# EAGLE design schematic (EAGLE 6.5.0)
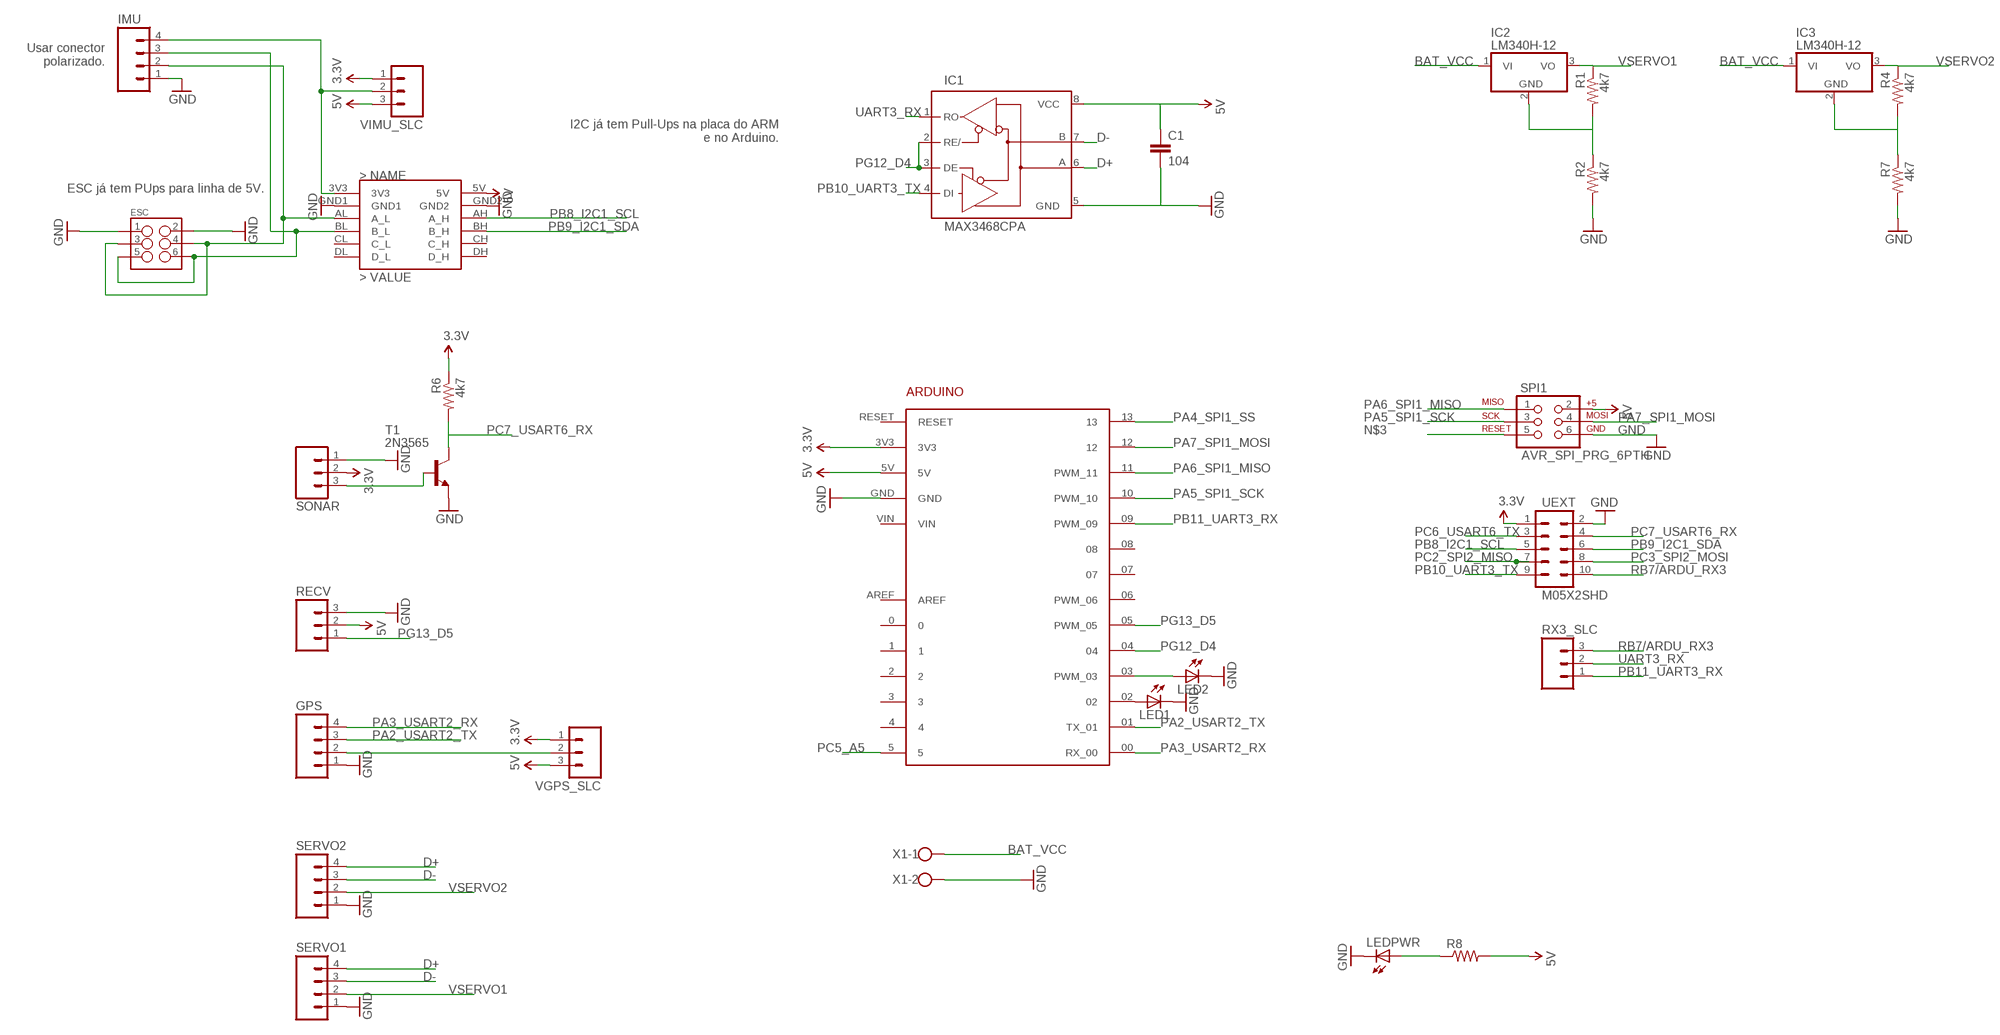
[diagram p0: schematic, sheet 1]

## Parts
ARDUINO1  ARDUINO  [ARDUINO]
C1  104  0.1UF-50V-20%(PTH)KIT-EZ  [CAP-PTH-SMALL-KIT]
ESC  M03X22X3_SILK_SM  [2X3]
GPS  M04PTH  [1X04]
IC1  MAX3468CPA  [DIL08]
IC2  LM340H-12  [TO220H]
IC3  LM340H-12  [TO220H]
IMU  M04PTH  [1X04]
LED1  LED3MM  [LED3MM]
LED2  LED3MM  [LED3MM]
LEDPWR  LED3MM  [LED3MM]
R1  4k7  R-US_0309/V  [0309V]
R2  4k7  R-US_0204/7  [0204/7]
R4  4k7  R-US_0309/V  [0309V]
R6  4k7  R-US_M1406  [M1406]
R7  4k7  R-US_0204/7  [0204/7]
R8  RESISTORPTH-1/6W  [1/6W-RES]
RECV  M03PTH  [1X03]
RX3_SLC  M03PTH  [1X03]
SERVO1  M04PTH  [1X04]
SERVO2  M04PTH  [1X04]
SONAR  M03PTH  [1X03]
SPI1  AVR_SPI_PRG_6PTH  [2X3]
T1  2N3565  [TO92]
U$1  JYMCU_LOGIC_LEVEL_CONVERTER  [JYMCU_LOGIC_LEVEL_SHIFTER_DIP]
UEXT  M05X2SHD  [2X5-SHROUDED]
VGPS_SLC  M03PTH  [1X03]
VIMU_SLC  M03PTH  [1X03]
X1  W237-102  [W237-102]

## Nets
3.3V: ARDUINO1.3V3 R6.1 SONAR.2 UEXT.1 VGPS_SLC.1 VIMU_SLC.1
5V: ARDUINO1.5V C1.1 IC1.8(VCC) R8.2 RECV.2 SPI1.2 U$1.5V VGPS_SLC.3 VIMU_SLC.3
BAT_VCC: IC2.1(VI) IC3.1(VI) X1.1
D+: IC1.6(A) SERVO1.4 SERVO2.4
D-: IC1.7(B) SERVO1.3 SERVO2.3
GND: ARDUINO1.GND C1.2 ESC.1 ESC.2 GPS.1 IC1.5(GND) IMU.1 LED1.K(C) LED2.K(C) LEDPWR.K(C) R2.2 R7.2 RECV.3 SERVO1.1 SERVO2.1 SONAR.1 SPI1.6 T1.3(E) U$1.GND1 U$1.GND2 UEXT.2 X1.2
N$1: IMU.4 U$1.3V3 VIMU_SLC.2
N$3: SPI1.5
N$6: SONAR.3 T1.2(B)
N$7: ESC.3 ESC.4 IMU.2 U$1.AL(A_L)
N$8: GPS.2 VGPS_SLC.2
N$9: ARDUINO1.02 LED1.A
N$10: ARDUINO1.03(PWM_03) LED2.A
N$11: LEDPWR.A R8.1
N$12: ESC.5 ESC.6 IMU.3 U$1.BL(B_L)
N$15: IC3.2(GND) R4.2 R7.1
N$16: IC2.2(GND) R1.2 R2.1
PA2_USART2_TX: ARDUINO1.01(TX_01) GPS.3
PA3_USART2_RX: ARDUINO1.00(RX_00) GPS.4
PA4_SPI1_SS: ARDUINO1.13
PA5_SPI1_SCK: ARDUINO1.10(PWM_10) SPI1.3
PA6_SPI1_MISO: ARDUINO1.11(PWM_11) SPI1.1
PA7_SPI1_MOSI: ARDUINO1.12 SPI1.4
PB8_I2C1_SCL: U$1.AH(A_H) UEXT.5
PB9_I2C1_SDA: U$1.BH(B_H) UEXT.6
PB10_UART3_TX: IC1.4(DI) UEXT.9
PB11_UART3_RX: ARDUINO1.09(PWM_09) RX3_SLC.1
PC2_SPI2_MISO: UEXT.7
PC3_SPI2_MOSI: UEXT.8
PC5_A5: ARDUINO1.5
PC6_USART6_TX: UEXT.3
PC7_USART6_RX: R6.2 T1.1(C) UEXT.4
PG12_D4: ARDUINO1.04 IC1.2(RE/) IC1.3(DE)
PG13_D5: ARDUINO1.05(PWM_05) RECV.1
RB7/ARDU_RX3: RX3_SLC.3 UEXT.10
UART3_RX: IC1.1(RO) RX3_SLC.2
VSERVO1: IC2.3(VO) R1.1 SERVO1.2
VSERVO2: IC3.3(VO) R4.1 SERVO2.2
Unconnected: ARDUINO1.0 ARDUINO1.1 ARDUINO1.2 ARDUINO1.3 ARDUINO1.4 ARDUINO1.06(PWM_06) ARDUINO1.07 ARDUINO1.08 ARDUINO1.AREF ARDUINO1.RESET ARDUINO1.VIN U$1.CH(C_H) U$1.CL(C_L) U$1.DH(D_H) U$1.DL(D_L)

## Notes on the sheet
- Usar conector
  polarizado.
- I2C já tem Pull-Ups na placa do ARM
  e no Arduino.
- ESC já tem PUps para linha de 5V.

## Library data of the parts
ARDUINO1 = arduino:ARDUINO: For creating Arduino shields
C1 = SparkFun-Capacitors:0.1UF-50V-20%(PTH): CAP-08370; PROD_ID: CAP-08370
ESC = SparkFun-Connectors:M03X2: 2x3 .1" header. Shrouded, with keying- CONN-10681 SMT- CONN-11415 Pogo pins- HW-11044
GPS IMU SERVO1 SERVO2 = SparkFun-Connectors:M04: Header 4 Standard 4-pin 0.1" header. Use with straight break away headers (SKU : PRT-00116), right angle break away headers (PRT-00553), swiss pins (PRT-00743), machine pins (PRT-00117), and female headers (PRT-00115). Molex polarized connector foot print use with SKU : PRT-08231 with associated crimp pins and housings. 1MM SMD Version SKU: PRT-10208
IC1 = maxim:MAX34*: +5V, Fail-Safe, 40Mbps, Profibus RS-485/RS-422 Transceivers Source: MAX3465-MAX3469.pdf; OC_FARNELL: unknown; OC_NEWARK: unknown
IC2 IC3 = linear:LM340?-*: Positive VOLTAGE REGULATOR Source: http://cache.national.com/ds/LM/LM340.pdf
LED1 LED2 LEDPWR = adafruit:LED: LED OSRAM: - CHIPLED LG R971, LG N971, LY N971, LG Q971, LY Q971, LO R971, LY R971 LH N974, LH R974 LS Q976, LO Q976, LY Q976 LO Q996 - Hyper CHIPLED LW Q18S LB Q993, LB Q99A, LB R99A - SideLED LS A670, LO A670, LY A670, LG A670, LP A670 LB A673, LV A673, LT A673, LW A673 LH A674 LY A675 LS A676, LA A676, LO A676, LY A676, LW A676 LS A679, LY A679, LG A679 - Hyper Micro SIDELED® LS Y876, LA Y876, LO Y876, LY Y876 LT Y87S - SmartLED LW L88C, LW L88S LB L89C, LB L89S, LG L890 LS L89K, LO L89K, LY L89K LS L896, LA L896, LO L896, LY L896 - TOPLED LS T670, LO T670, LY T670, LG T670, LP T670 LSG T670, LSP T670, LSY T670, LOP T670, LYG T670 LG T671, LOG T671, LSG T671 LB T673, LV T673, LT T673, LW T673 LH T674 LS T676, LA T676, LO T676, LY T676, LB T676, LH T676, LSB T676, LW T676 LB T67C, LV T67C, LT T67C, LS T67K, LO T67K, LY T67K, LW E67C LS E67B, LA E67B, LO E67B, LY E67B, LB E67C, LV E67C, LT E67C LW T67C LS T679, LY T679, LG T679 LS T770, LO T770, LY T770, LG T770, LP T770 LB T773, LV T773, LT T773, LW T773 LH T774 LS E675, LA E675, LY E675, LS T675 LS T776, LA T776, LO T776, LY T776, LB T776 LHGB T686 LT T68C, LB T68C - Hyper Mini TOPLED® LB M676 - Mini TOPLED Santana® LG M470 LS M47K, LO M47K, LY M47K Source: http://www.osram.convergy.de/
R1 R2 R4 R6 R7 = adafruit:R-US_: RESISTOR, American symbol
R8 = SparkFun-Passives:RESISTOR: Resistor Basic schematic elements and footprints for 0603, 1206, and PTH resistors.
RECV RX3_SLC SONAR VGPS_SLC VIMU_SLC = SparkFun-Connectors:M03: Header 3 Standard 3-pin 0.1" header. Use with straight break away headers (SKU : PRT-00116), right angle break away headers (PRT-00553), swiss pins (PRT-00743), machine pins (PRT-00117), and female headers (PRT-00115). Molex polarized connector foot print use with SKU : PRT-08232 with associated crimp pins and housings.
SPI1 = SparkFun-Connectors:AVR_SPI_PRG_6: AVR ISP 6 Pin This is the reduced ISP connector for AVR programming. Common on Arduino. This footprint will take up less PCB space and can be used with a 10-pin to 6-pin adapter such as SKU: BOB-08508
T1 = transistor:2N3565: NPN TRANSISTOR
U$1 = provant_custom:JYMCU_LOGIC_LEVEL_CONVERTER
UEXT = SparkFun-Connectors:M05X2: Header 5x2 Standard 10-pin dual row 0.1" header. Commonly used with AVR-ISP. Use with Spark Fun Electronics SKU: PRT-00778
X1 = con-wago-500:W237-102: WAGO SCREW CLAMP; MPN: 237-102; OC_FARNELL: unknown; OC_NEWARK: 70K9898

## Board
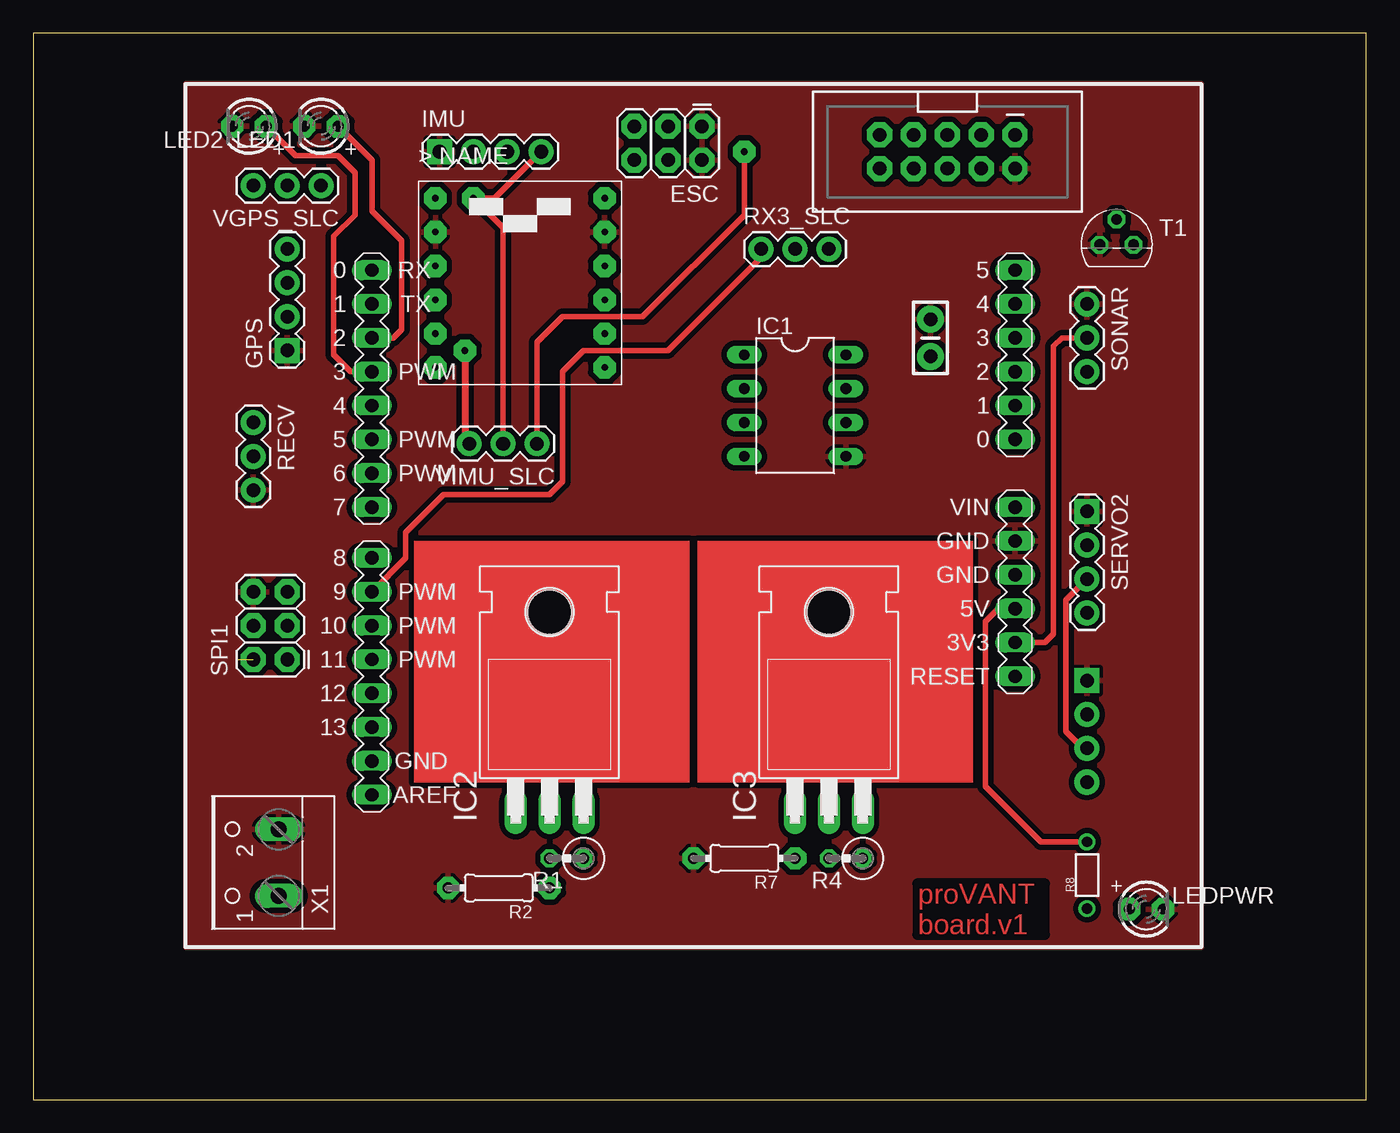
[diagram p1: board, top side]
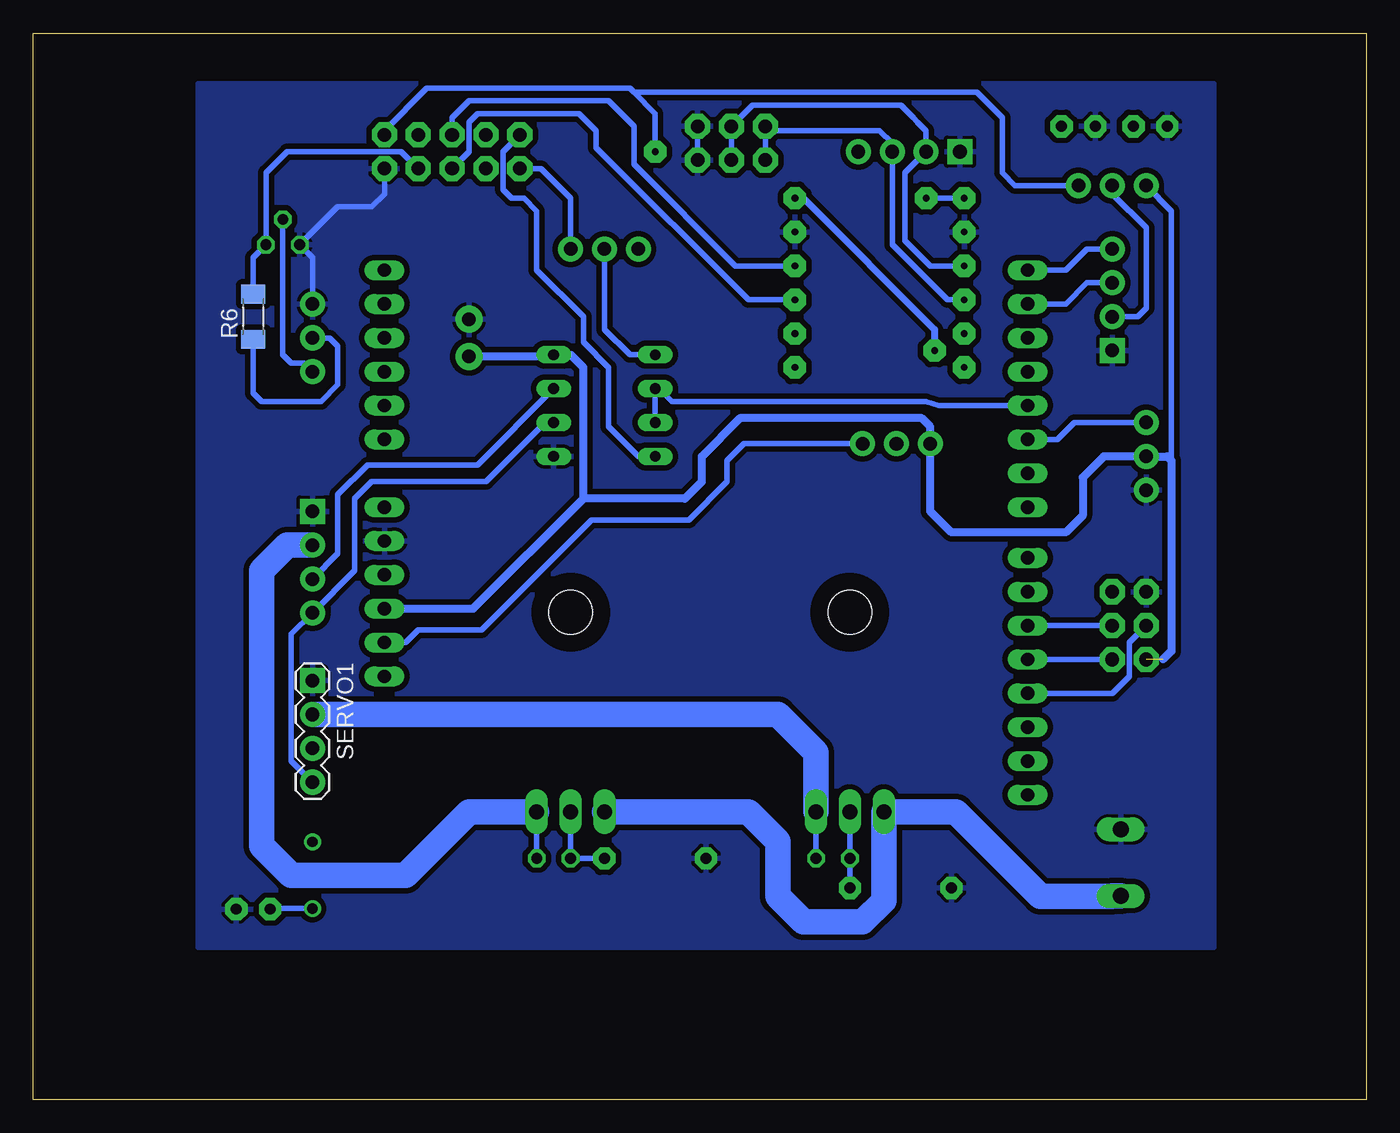
[diagram p2: board, bottom side, seen from below]

Size 100 x 80 mm. Coordinates in mm from the lower left corner, seen from the top.
Outline: 0,0 100,0 100,80 0,80 0,0
Copper layers (1*16): Top 0.035mm / dielectric 1.5mm / Bottom 0.035mm
Design rules "default": minimum track width 10mil, minimum drill 24mil, track to track 8mil, track to pad 8mil, pad to pad 8mil, via to via 8mil, smd to smd 8mil, copper to edge 40mil, drill to drill 8mil, minimum pad ring 10mil, minimum via ring 8mil, stop-mask expansion 4mil, vias tented up to drill 0mil, thermal gap 10mil

### Footprints (pad centres in the part's own frame; a part is rotated, then mirrored left to right if it is on the bottom)
ARDUINO = drill 1 long: 00 25.4,-20.32; 0 -22.86,-7.62; 01 25.4,-17.78; 1 -22.86,-10.16; 02 25.4,-15.24; 2 -22.86,-12.7; 03 25.4,-12.7; 3 -22.86,-15.24; 3V3 -22.86,7.62; 04 25.4,-10.16; 4 -22.86,-17.78; 05 25.4,-7.62; 5 -22.86,-20.32; 5V -22.86,5.08; 06 25.4,-5.08; 07 25.4,-2.54; 08 25.4,1.27; 09 25.4,3.81; 10 25.4,6.35; 11 25.4,8.89; 12 25.4,11.43; 13 25.4,13.97; AREF 25.4,19.05; GND -22.86,0; GND2 -22.86,2.54; GND3 25.4,16.51; RESET -22.86,10.16; VIN -22.86,-2.54
CAP-PTH-SMALL-KIT = drill 1.016 pad 2.032: 1 -1.397,0; 2 1.397,0
2X3 = drill 1.016 pad 1.88 octagon: 1 0,0; 2 0,2.54; 3 2.54,0; 4 2.54,2.54; 5 5.08,0; 6 5.08,2.54
1X04 = drill 1.016 pad 1.88 square: 1 0,0 | drill 1.016 pad 1.88: 2 2.54,0; 3 5.08,0; 4 7.62,0
DIL08 = drill 0.813 long: 1 -3.81,-3.81; 2 -1.27,-3.81; 3 1.27,-3.81; 4 3.81,-3.81; 5 3.81,3.81; 6 1.27,3.81; 7 -1.27,3.81; 8 -3.81,3.81
TO220H = drill 1.118 long: 1 -2.54,-10.16; 2 0,-10.16; 3 2.54,-10.16 | hole 3.302: 0,4.826
LED3MM = drill 0.813 pad 1.676 octagon: A -1.27,0; K 1.27,0
0309V = drill 0.813 octagon: 1 -1.27,0; 2 1.27,0
0204/7 = drill 0.813 pad 1.676 octagon: 1 -3.81,0; 2 3.81,0
M1406 = smd 1.4 x 1.8: 1 -1.7,0; 2 1.7,0
1/6W-RES = drill 0.762: 1 -2.5,0; 2 2.5,0
1X03 = drill 1.016 pad 1.88: 1 0,0; 2 2.54,0; 3 5.08,0
TO92 = drill 0.813 octagon: 1 1.27,0; 2 0,1.905; 3 -1.27,0
JYMCU_LOGIC_LEVEL_SHIFTER_DIP = drill 0.5 pad 1.676 octagon: 3V3 -6.35,6.35; 5V 6.35,6.35; AH 6.35,1.27; AL -6.35,1.27; BH 6.35,-1.27; BL -6.35,-1.27; CH 6.35,-3.81; CL -6.35,-3.81; DH 6.35,-6.35; DL -6.35,-6.35; GND1 -6.35,3.81; GND2 6.35,3.81
2X5-SHROUDED = drill 1.016 pad 1.88 octagon: 1 -1.27,5.08; 2 1.27,5.08; 3 -1.27,2.54; 4 1.27,2.54; 5 -1.27,0; 6 1.27,0; 7 -1.27,-2.54; 8 1.27,-2.54; 9 -1.27,-5.08; 10 1.27,-5.08
W237-102 = drill 1.194 long: 1 -2.5,-1.27; 2 2.5,-1.27

### Placement (x,y rotation side)
ARDUINO1  50.8,41.91 180 top
C1  67.31,57.15 90 top
ESC  50.16,73.03 180 top
GPS  19.05,56.2 90 top
IC1  57.15,52.07 270 top
IC2  38.73,31.75 0 top
IC3  59.69,31.75 0 top
IMU  30.48,71.12 0 top
LED1  21.59,73.03 180 top
LED2  16.19,73.03 180 top
LEDPWR  83.5,14.29 0 top
R1  40.01,18.1 180 top
R2  34.92,15.88 180 top
R4  60.96,18.1 180 top
R6  83.5,58.74 90 bottom
R7  53.34,18.1 180 top
R8  79.06,16.83 90 top
RECV  16.51,50.8 270 top
RX3_SLC  54.61,63.82 0 top
SERVO1  79.06,31.43 270 bottom
SERVO2  79.06,44.13 270 top
SONAR  79.06,59.69 270 top
SPI1  19.05,33.02 90 top
T1  81.28,64.14 0 top
U$1  36.51,61.28 0 top
UEXT  68.58,71.12 270 top
VGPS_SLC  21.59,68.58 180 top
VIMU_SLC  37.78,49.21 180 top
X1  17.14,17.78 90 top

### Tracks (layer width: path | path; a pad name or v marks a point on that pad's centre or on a via)
3.3V  (via drill 0.5 pad 1.68)
  Top 0.406: VIMU_SLC.1 37.78,56.83 39.69,58.74 45.72,58.74 53.34,66.36 v53.34,71.12 | ARDUINO1.3V3 75.88,34.29 76.52,34.92 76.52,56.52 77.15,57.15 SONAR.2
  Bottom 0.406: v53.34,71.12 53.34,73.98 54.93,75.56 | UEXT.1 73.66,72.71 70.48,75.88 55.24,75.88 55.09,75.72 54.93,75.56 | VIMU_SLC.1 46.67,49.21 47.94,47.94 47.94,46.35 50.8,43.5 58.1,43.5 66.36,35.24 71.12,35.24 72.07,34.29 ARDUINO1.3V3 | R6.1 83.5,53.02 82.87,52.39 78.42,52.39 77.15,53.66 77.15,56.52 77.79,57.15 SONAR.2 | VGPS_SLC.1 26.35,68.58 27.3,69.53 27.3,73.66 29.21,75.56 54.93,75.56
5V  (via drill 0.5 pad 1.68)  (1 unrouted)
  Top 0.406: R8.2 75.61,19.33 71.44,23.5 71.44,35.88 72.39,36.83 ARDUINO1.5V
  Top 0.508: v32.38,56.2 32.38,49.53 VIMU_SLC.3
  Bottom 0.406: 59.69,55.88 IC1.8 | 14.61,47.94 14.61,66.67 VGPS_SLC.3
  Bottom 0.508: U$1.5V 42.23,67.63 32.38,57.78 v32.38,56.2
  Bottom 0.61: IC1.8 61.09,55.75 C1.1 | ARDUINO1.5V 66.99,36.83 58.74,45.09 | 58.74,45.09 58.74,54.93 59.69,55.88 | 15.24,33.02 14.61,33.66 14.61,47.94 14.92,48.26 RECV.2 19.68,48.26 21.27,46.67 21.27,43.81 22.54,42.55 31.11,42.55 32.7,44.13 VIMU_SLC.3 32.7,50.48 33.34,51.12 46.99,51.12 49.85,48.26 49.85,46.35 51.12,45.09 58.74,45.09
BAT_VCC
  Bottom 1.93: X1.1 19.05,15.28 19.09,15.24 24.45,15.24 30.8,21.59 IC2.1 36.2,14.92 37.78,13.34 42.23,13.34 44.13,15.24 44.13,19.37 46.35,21.59 IC3.1
D+
  Bottom 0.406: SERVO1.4 80.64,25.4 80.64,34.92 SERVO2.4 75.88,39.69 75.88,45.09 74.61,46.35 66.04,46.35 61.59,50.8 IC1.6
D-
  Top 0.406: SERVO2.3 77.47,37.47 77.47,27.62 78.74,26.35 SERVO1.3
  Bottom 0.406: IC1.7 66.67,47.62 74.93,47.62 77.15,45.4 77.15,40.96 SERVO2.3
GND
  Bottom 0.406: ESC.1 ESC.2 | UEXT.2 73.66,67.94 74.61,66.99 77.15,66.99 T1.3 79.06,63.18 SONAR.1
  pour Bottom (isolate 0.406): 11.43,76.2 87.63,76.2 87.63,11.43 11.43,11.43
  pour Top (isolate 0.406): 11.43,76.2 87.63,76.2 87.63,11.43 11.43,11.43
N$1  (via drill 0.5 pad 1.68)
  Top 0.406: VIMU_SLC.2 35.24,65.41 v33.02,67.63 34.61,67.63 IMU.4
  Bottom 0.406: v33.02,67.63 U$1.3V3
N$6
  Bottom 0.406: SONAR.3 79.69,55.24 80.64,55.24 81.28,55.88 T1.2
N$7
  Bottom 0.406: ESC.4 ESC.3 46.04,74.61 34.92,74.61 33.97,73.66 33.66,73.34 33.02,72.71 IMU.2 34.61,69.53 34.61,64.45 32.7,62.55 U$1.AL
N$8
  Bottom 0.406: VGPS_SLC.2 19.05,67.94 16.51,65.41 16.51,59.37 17.14,58.74 GPS.2
N$9
  Top 0.406: ARDUINO1.02 26.99,57.15 27.62,57.78 27.62,64.45 25.4,66.67 25.4,70.48 LED1.A
N$10
  Top 0.406: ARDUINO1.03 23.81,54.61 22.54,55.88 22.54,64.77 24.13,66.36 24.13,69.53 22.86,70.8 19.68,70.8 LED2.A
N$11
  Bottom 0.406: R8.1 82.19,14.33 LEDPWR.A
N$12
  Bottom 0.406: 45.09,69.85 ESC.6 ESC.5 44.77,72.71 36.51,72.71 35.56,71.75 IMU.3 35.56,64.14 31.43,60.01 U$1.BL
N$15
  Bottom 0.406: IC3.2 R4.2 R7.1
N$16
  Bottom 0.406: IC2.2 R1.2 R2.1
PA2_USART2_TX
  Bottom 0.406: ARDUINO1.01 22.54,59.69 20.95,61.28 GPS.3
PA3_USART2_RX
  Bottom 0.406: ARDUINO1.00 22.54,62.23 20.95,63.82 GPS.4
PA5_SPI1_SCK
  Bottom 0.406: ARDUINO1.10 SPI1.3
PA6_SPI1_MISO
  Bottom 0.406: ARDUINO1.11 SPI1.1
PA7_SPI1_MOSI
  Bottom 0.406: ARDUINO1.12 19.05,30.48 17.78,31.75 17.78,34.29 SPI1.4
PB8_I2C1_SCL
  Bottom 0.406: 68.58,73.03 UEXT.5 68.58,73.66 67.31,74.93 56.83,74.93 54.93,73.03 54.93,70.17 47.31,62.55 U$1.AH
PB9_I2C1_SDA
  Bottom 0.406: UEXT.6 67.31,71.12 67.31,73.34 66.67,73.98 59.05,73.98 57.78,72.71 57.78,71.44 46.35,60.01 U$1.BH
PB10_UART3_TX
  Bottom 0.406: IC1.4 54.61,48.26 56.83,50.48 56.83,54.93 58.74,56.83 58.74,58.74 62.23,62.23 62.23,66.67 63.18,67.63 64.14,67.63 64.77,68.26 64.77,71.12 UEXT.9
PB11_UART3_RX
  Top 0.406: RX3_SLC.1 54.61,63.18 47.62,56.2 41.27,56.2 39.69,54.61 39.69,46.35 38.73,45.4 30.8,45.4 27.94,42.55 27.94,40.64 ARDUINO1.09
PC7_USART6_RX
  Bottom 0.406: R6.2 83.5,63.18 T1.1 82.55,69.53 80.96,71.12 72.39,71.12 UEXT.4
PG12_D4
  Bottom 0.406: IC1.3 IC1.2 53.02,53.34 52.07,52.39 33.02,52.39 32.07,52.07 ARDUINO1.04
PG13_D5
  Bottom 0.406: ARDUINO1.05 23.18,49.53 21.91,50.8 RECV.1
RB7/ARDU_RX3
  Bottom 0.406: UEXT.10 61.91,69.85 59.69,67.63 RX3_SLC.3
UART3_RX
  Bottom 0.406: RX3_SLC.2 57.15,57.78 55.24,55.88 IC1.1
VSERVO1
  Bottom 0.406: R1.1 IC2.3
  Bottom 1.93: SERVO1.2 44.13,28.89 41.27,26.04 IC2.3
VSERVO2
  Bottom 0.406: R4.1 IC3.3
  Bottom 1.93: SERVO2.2 80.96,41.59 82.87,39.69 82.87,19.05 80.64,16.83 72.07,16.83 67.31,21.59 IC3.3
(copper drawn outside any net)
  shapes: Top area x2

### Text on the board
Top: proVANT / board.v1